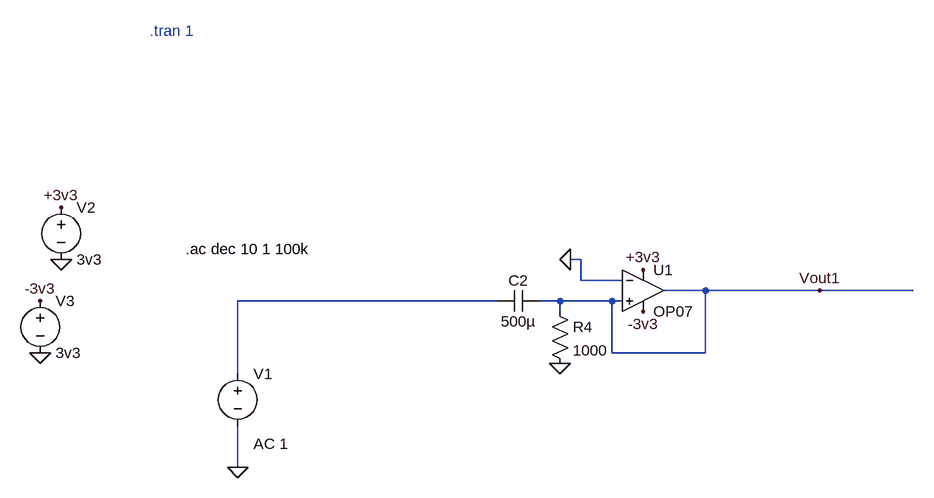
[diagram p0: schematic EMG_HPF_filter_test.asc]
EMG_HPF_filter_test.asc, the LTspice schematic file:
Version 4.1
SHEET 1 1700 712
WIRE 544 128 528 128
WIRE 544 160 544 128
WIRE 608 160 544 160
WIRE 736 176 672 176
WIRE 912 176 736 176
WIRE 1056 176 912 176
WIRE 416 192 16 192
WIRE 512 192 480 192
WIRE 592 192 512 192
WIRE 608 192 592 192
WIRE 512 208 512 192
WIRE 592 272 592 192
WIRE 736 272 736 176
WIRE 736 272 592 272
WIRE 16 304 16 192
WIRE 16 448 16 384
FLAG -256 128 0
FLAG -288 272 0
FLAG -256 48 +3v3
FLAG -288 192 -3v3
FLAG 512 288 0
FLAG 528 128 0
FLAG 640 208 -3v3
FLAG 640 144 +3v3
FLAG 16 448 0
FLAG 912 176 Vout1
SYMBOL voltage -256 32 R0
WINDOW 123 0 0 Left 0
WINDOW 39 0 0 Left 0
SYMATTR InstName V2
SYMATTR Value 3v3
SYMBOL voltage -288 176 R0
WINDOW 123 0 0 Left 0
WINDOW 39 0 0 Left 0
SYMATTR InstName V3
SYMATTR Value 3v3
SYMBOL OpAmps\\OP07 640 112 R0
SYMATTR InstName U1
SYMBOL cap 480 176 R90
WINDOW 0 0 32 VBottom 2
WINDOW 3 32 32 VTop 2
SYMATTR InstName C2
SYMATTR Value 500µ
SYMBOL res 496 192 R0
SYMATTR InstName R4
SYMATTR Value 1000
SYMBOL voltage 16 288 R0
WINDOW 123 24 124 Left 2
WINDOW 39 0 0 Left 0
SYMATTR Value2 AC 1
SYMATTR InstName V1
SYMATTR Value ""
TEXT -120 -224 Left 2 ;.tran 1
TEXT -64 112 Left 2 !.ac dec 10 1 100k

The netlist it stands for:
* EMG_HPF_filter_test.asc
V2 +3v3 0 3v3
V3 -3v3 0 3v3
X§U1 Vout1 0 +3v3 -3v3 Vout1 LT1001  ; OP07, pins In+ In- V+ V- OUT
C2 Vout1 N001 500µ
R4 Vout1 0 1000
V1 N001 0 AC 1
* .tran 1
.ac dec 10 1 100k
.lib LTC.lib
.backanno
.end